# Altium project ESC_Project.PrjPcb
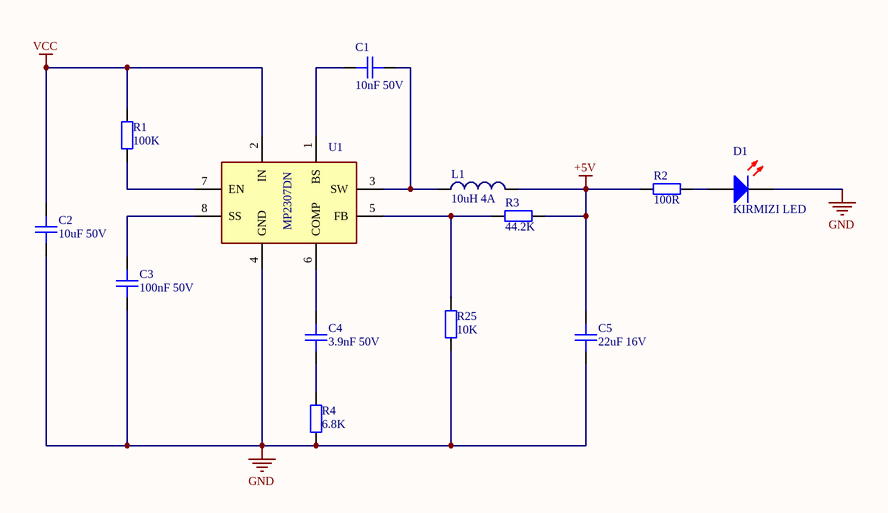
[diagram p0: Power.SchDoc]
3 sheets, 62 parts. Net scope: global (net labels, ports and power ports of the same name join across sheets).
Board file: ESC_PCB.PcbDoc
Sheets:
  Power.SchDoc
  Driver.SchDoc
  MCU.SchDoc

## Sheet Power.SchDoc
size A4

### Parts
C1  Deger: 10nF 50V  [CAP 0805/2012]  (hidden comment: CAP CER 10000PF 50V X7R 0805)
C2  Deger: 10uF 50V  [CAP 1206/3216]  (hidden comment: CAP CER 10UF 50V X5R 1206)
C3  Deger: 100nF 50V  [CAP 0805/2012]  (hidden comment: CAP CER 0.1UF 50V X7R 0805)
C4  Deger: 3.9nF 50V  [CAP 0805/2012]  (hidden comment: CAP CER 3900PF 50V X7R 0805)
C5  Deger: 22uF 16V  [CAP 1206/3216]  (hidden comment: CAP CERAMIC 22UF 16V X7S 20% PAD)
D1  Deger: KIRMIZI LED  [SMD: LED 0805/2012 RED]  (hidden comment: Red 645nm LED Indication - Discrete 1.8V 0805)
L1  FIXED IND 10UH 4A 68 MOHM SMD  [ASPI-0630LR-100M-T15]  (value not drawn)
R1  Deger: 100K  [RES_0805]  (hidden comment: RES SMD 100K OHM 1% 1/8W 0805)
R2  Deger: 100R  [RES_0805]  (hidden comment: RES SMD 100 OHM 1% 1/8W 0805)
R3  Deger: 44.2K  [RES_0805]  (hidden comment: RES SMD 44.2K OHM 1% 1/8W 0805)
R4  Deger: 6.8K  [RES_0805]  (hidden comment: RES SMD 6.8K OHM 1% 1/8W 0805)
R25  Deger: 10K  [RES_0805]  (hidden comment: RES SMD 10K OHM 1% 1/8W 0805)
U1  IC REG BUCK ADJUSTABLE 3A 8SOIC  [SOIC8_PAD]  (value not drawn)

### Nets
+5V: C5.2 L1.2 R2.1 R3.2
GND: C2.1 C3.1 C5.1 D1.2(K) R4.1 R25.1 U1.4(GND)
VCC: C2.2 R1.2 U1.2(IN)
NetC1_1: C1.1 U1.1(BS)
NetC1_2: C1.2 L1.1 U1.3(SW)
NetC3_2: C3.2 U1.8(SS)
NetC4_1: C4.1 R4.2
NetC4_2: C4.2 U1.6(COMP)
NetD1_1: D1.1(A) R2.2
NetR1_1: R1.1 U1.7(EN)
NetR3_1: R3.1 R25.2 U1.5(FB)

### Library data of the parts
C1 = 10nF 50V 0805: 10000pF ±10% 50V Ceramic Capacitor X7R 0805 (2012 Metric); Cins: Kondansator; Uretici Kodu: CL21B103KBANNNC; Kılıf: 0805; -Sicaklik: -55; +Sicaklik: +125; Lehim Yöntemi: SMD; MSL: 1 (Unlimited)
C2 = 10uF 50V 1206: 10µF ±10% 50V Ceramic Capacitor X5R 1206 (3216 Metric); Cins: Kondansator; Uretici Kodu: CL31A106KBHNNNE; Kılıf: 1206; -Sicaklik: -55; +Sicaklik: +125; Lehim Yöntemi: SMD; MSL: 1 (Unlimited)
C3 = 100nF 50V 0805: 0.1µF ±10% 50V Ceramic Capacitor X7R 0805 (2012 Metric); Kılıf: 0805; Cins: Kondansator; Uretici Kodu: CL21B104KBCNNNC; -Sicaklik: -55; +Sicaklik: +125; Lehim Yöntemi: SMD; MSL: 1 (Unlimited)
C4 = 3.9nF 50V 0805: 3900pF ±10% 50V Ceramic Capacitor X7R 0805 (2012 Metric); Cins: Kondansator; Uretici Kodu: CL21B392KBANNNC; Kılıf: 0805; -Sicaklik: -55; +Sicaklik: +125; Lehim Yöntemi: SMD; MSL: 1 (Unlimited)
C5 = 22uF 16V 1206: 22µF ±20% 16V Ceramic Capacitor X7S 1206 (3216 Metric); Cins: Kondansator; Uretici Kodu: GRM31CC71C226ME11L; Kılıf: 1206; -Sicaklik: -55; +Sicaklik: +125; Lehim Yöntemi: SMD; MSL: 1 (Unlimited)
D1 = LED_Kırmızı: LED RED DIFFUSED 0805 SMD; Uretici Kodu: LH R974-LP-1; Kılıf: 0805; -Sicaklik: -40; +Sicaklik: +125; Cins: LED; Lehim Yöntemi: SMD; MSL: 1 (Unlimited)
L1 = 10uH 4A: 10µH Shielded Molded Inductor 4A 68mOhm Max Nonstandard; Cins: Bobin; -Sicaklik: -55; +Sicaklik: +125; Uretici Kodu: ASPI-0630LR-100M-T15; Kılıf: Nonstandard; Lehim Yöntemi: SMD; MSL: 1 (Unlimited); Deger: 10uH 4A
R1 = 100K 0805: 100 kOhms ±1% 0.125W, 1/8W Chip Resistor 0805 (2012 Metric) Moisture Resistant Thick Film; Cins: Direnc; Uretici Kodu: RC0805FR-07100KL; Kılıf: 0805; -Sicaklik: -55; +Sicaklik: +155; Lehim Yöntemi: SMD; MSL: 1 (Unlimited)
R2 = 100R 0805: 100 Ohms ±1% 0.125W, 1/8W Chip Resistor 0805 (2012 Metric) Moisture Resistant Thick Film; Cins: Direnc; Uretici Kodu: RC0805FR-07100RL; Kılıf: 0805; -Sicaklik: -55; +Sicaklik: +155; Lehim Yöntemi: SMD; MSL: 1 (Unlimited)
R3 = 44.2K 0805: 44.2 kOhms ±1% 0.125W, 1/8W Chip Resistor 0805 (2012 Metric) Moisture Resistant Thick Film; Cins: Direnc; Uretici Kodu: RC0805FR-0744K2L; Kılıf: 0805; -Sicaklik: -55; +Sicaklik: +155; Lehim Yöntemi: SMD; MSL: 1 (Unlimited)
R4 = 6.8K 0805: 6.8 kOhms ±1% 0.125W, 1/8W Chip Resistor 0805 (2012 Metric) Moisture Resistant Thick Film; Cins: Direnc; Kılıf: 0805; Uretici Kodu: RC0805FR-076K8L; -Sicaklik: -55; +Sicaklik: +155; Lehim Yöntemi: SMD; MSL: 1 (Unlimited)
R25 = 10K 0805: 10 kOhms ±1% 0.125W, 1/8W Chip Resistor 0805 (2012 Metric) Moisture Resistant Thick Film; Cins: Direnc; Kılıf: 0805; Uretici Kodu: RC0805FR-0710KL; -Sicaklik: -55; +Sicaklik: +155; Lehim Yöntemi: SMD; MSL: 1 (Unlimited)
U1 = MP2307DN: Buck Switching Regulator IC Positive Adjustable 0.925V 1 Output 3A 8-SOIC (0.154", 3.90mm Width) Exposed Pad; Uretici Kodu: MP2307DN-LF-Z; -Sicaklik: -40; +Sicaklik: +85; Lehim Yöntemi: SMD; Cins: IC; Kılıf: 8-SOIC; MSL: 2A (4 Weeks); Deger: MP2307DN

## Sheet Driver.SchDoc
size A4
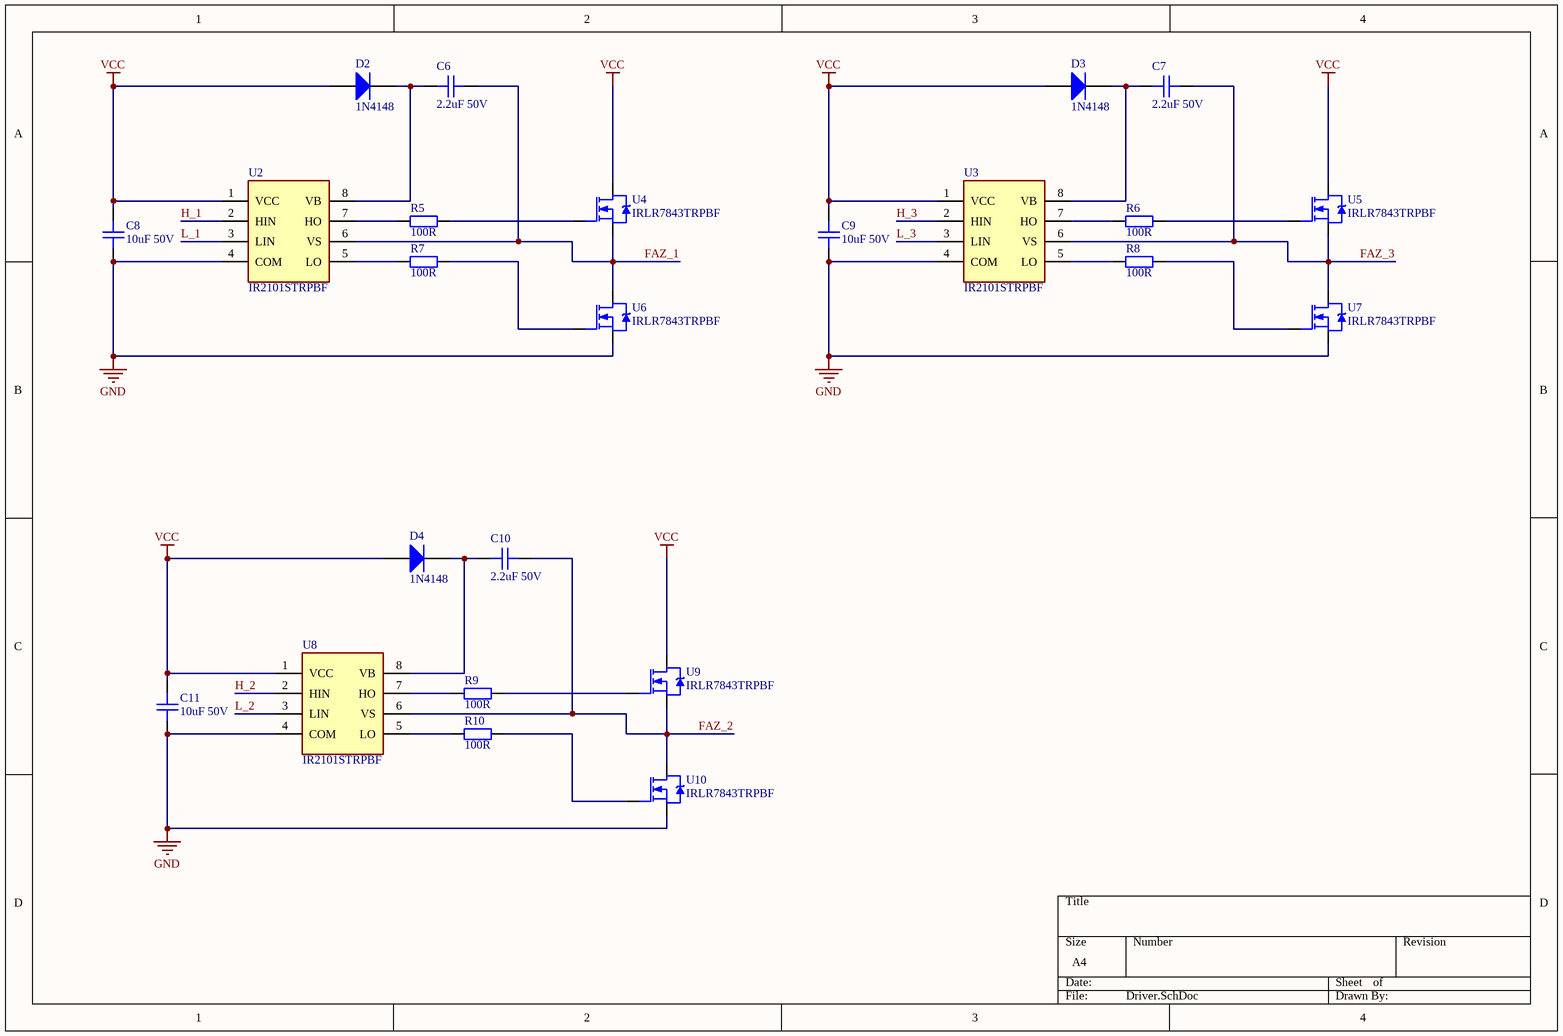
[diagram p1: Driver.SchDoc]

### Parts
C6  Deger: 2.2uF 50V  [CAP 1206/3216]  (hidden comment: CAP CER 2.2UF 50V X5R 1206)
C7  Deger: 2.2uF 50V  [CAP 1206/3216]  (hidden comment: CAP CER 2.2UF 50V X5R 1206)
C8  Deger: 10uF 50V  [CAP 1206/3216]  (hidden comment: CAP CER 10UF 50V X5R 1206)
C9  Deger: 10uF 50V  [CAP 1206/3216]  (hidden comment: CAP CER 10UF 50V X5R 1206)
C10  Deger: 2.2uF 50V  [CAP 1206/3216]  (hidden comment: CAP CER 2.2UF 50V X5R 1206)
C11  Deger: 10uF 50V  [CAP 1206/3216]  (hidden comment: CAP CER 10UF 50V X5R 1206)
D2  1N4148 Diyot  [SOD-123]  (value not drawn)
D3  1N4148 Diyot  [SOD-123]  (value not drawn)
D4  1N4148 Diyot  [SOD-123]  (value not drawn)
R5  Deger: 100R  [RES_0805]  (hidden comment: RES SMD 100 OHM 1% 1/8W 0805)
R6  Deger: 100R  [RES_0805]  (hidden comment: RES SMD 100 OHM 1% 1/8W 0805)
R7  Deger: 100R  [RES_0805]  (hidden comment: RES SMD 100 OHM 1% 1/8W 0805)
R8  Deger: 100R  [RES_0805]  (hidden comment: RES SMD 100 OHM 1% 1/8W 0805)
R9  Deger: 100R  [RES_0805]  (hidden comment: RES SMD 100 OHM 1% 1/8W 0805)
R10  Deger: 100R  [RES_0805]  (hidden comment: RES SMD 100 OHM 1% 1/8W 0805)
U2  Deger: IR2101STRPBF  [SOIC8]  (hidden comment: IC GATE DRVR HALF-BRIDGE 8SOIC)
U3  Deger: IR2101STRPBF  [SOIC8]  (hidden comment: IC GATE DRVR HALF-BRIDGE 8SOIC)
U4  Deger: IRLR7843TRPBF  [DPAK]  (hidden comment: MOSFET N-CH 30V 161A DPAK)
U5  Deger: IRLR7843TRPBF  [DPAK]  (hidden comment: MOSFET N-CH 30V 161A DPAK)
U6  Deger: IRLR7843TRPBF  [DPAK]  (hidden comment: MOSFET N-CH 30V 161A DPAK)
U7  Deger: IRLR7843TRPBF  [DPAK]  (hidden comment: MOSFET N-CH 30V 161A DPAK)
U8  Deger: IR2101STRPBF  [SOIC8]  (hidden comment: IC GATE DRVR HALF-BRIDGE 8SOIC)
U9  Deger: IRLR7843TRPBF  [DPAK]  (hidden comment: MOSFET N-CH 30V 161A DPAK)
U10  Deger: IRLR7843TRPBF  [DPAK]  (hidden comment: MOSFET N-CH 30V 161A DPAK)

### Nets
GND: C8.1 C9.1 C11.1 U2.4(COM) U3.4(COM) U6.3(S) U7.3(S) U8.4(COM) U10.3(S)
VCC: C8.2 C9.2 C11.2 D2.1(A) D3.1(A) D4.1(A) U2.1(VCC) U3.1(VCC) U4.4(D) U5.4(D) U8.1(VCC) U9.4(D)
FAZ_1: C6.2 U2.6(VS) U4.3(S) U6.4(D)
FAZ_2: C10.2 U8.6(VS) U9.3(S) U10.4(D)
FAZ_3: C7.2 U3.6(VS) U5.3(S) U7.4(D)
H_1: U2.2(HIN)
H_2: U8.2(HIN)
H_3: U3.2(HIN)
L_1: U2.3(LIN)
L_2: U8.3(LIN)
L_3: U3.3(LIN)
NetC6_1: C6.1 D2.2(K) U2.8(VB)
NetC7_1: C7.1 D3.2(K) U3.8(VB)
NetC10_1: C10.1 D4.2(K) U8.8(VB)
NetR5_1: R5.1 U2.7(HO)
NetR5_2: R5.2 U4.1(G)
NetR6_1: R6.1 U3.7(HO)
NetR6_2: R6.2 U5.1(G)
NetR7_1: R7.1 U2.5(LO)
NetR7_2: R7.2 U6.1(G)
NetR8_1: R8.1 U3.5(LO)
NetR8_2: R8.2 U7.1(G)
NetR9_1: R9.1 U8.7(HO)
NetR9_2: R9.2 U9.1(G)
NetR10_1: R10.1 U8.5(LO)
NetR10_2: R10.2 U10.1(G)

### Library data of the parts
C6 C7 C10 = 2.2uF 50V 1206: 2.2µF ±10% 50V Ceramic Capacitor X5R 1206 (3216 Metric); Cins: Kondansator; Uretici Kodu: CL31A225KBHNNNE; Kılıf: 1206; -Sicaklik: -55; +Sicaklik: +85; Lehim Yöntemi: SMD; MSL: 1 (Unlimited)
C8 C9 C11 = 10uF 50V 1206: as C2 on sheet Power; MSL: 1 (Unlimited)
D2-D4 = 1N4148: DIODE GEN PURP 100V 150MA SOD123; Uretici Kodu: 1N4148W-TP; -Sicaklik: -65; +Sicaklik: +150; Lehim Yöntemi: SMD; Cins: Diyot; Kılıf: SOD123; MSL: 1 (Unlimited); Deger: 1N4148
R5-R10 = 100R 0805: as R2 on sheet Power; Lehim Yöntemi: SMD; MSL: 1 (Unlimited)
U2 U3 U8 = IR2101: Half-Bridge Gate Driver IC Non-Inverting 8-SOIC; -Sicaklik: -40; +Sicaklik: +150; Lehim Yöntemi: SMD; Cins: IC; Uretici Kodu: IR2101STRPBF; Kılıf: 8-SOIC; MSL: 2A (4 Weeks)
U4-U7 U9 U10 = IRLR7843: N-Channel 30V 161A (Tc) 140W (Tc) Surface Mount D-Pak; Kılıf: DPAK(TO-252-3); -Sicaklik: -55; +Sicaklik: +175; Lehim Yöntemi: SMD; Cins: MOSFET; Uretici Kodu: IRLR7843TRPBF; MSL: 1 (Unlimited)

## Sheet MCU.SchDoc
size A4
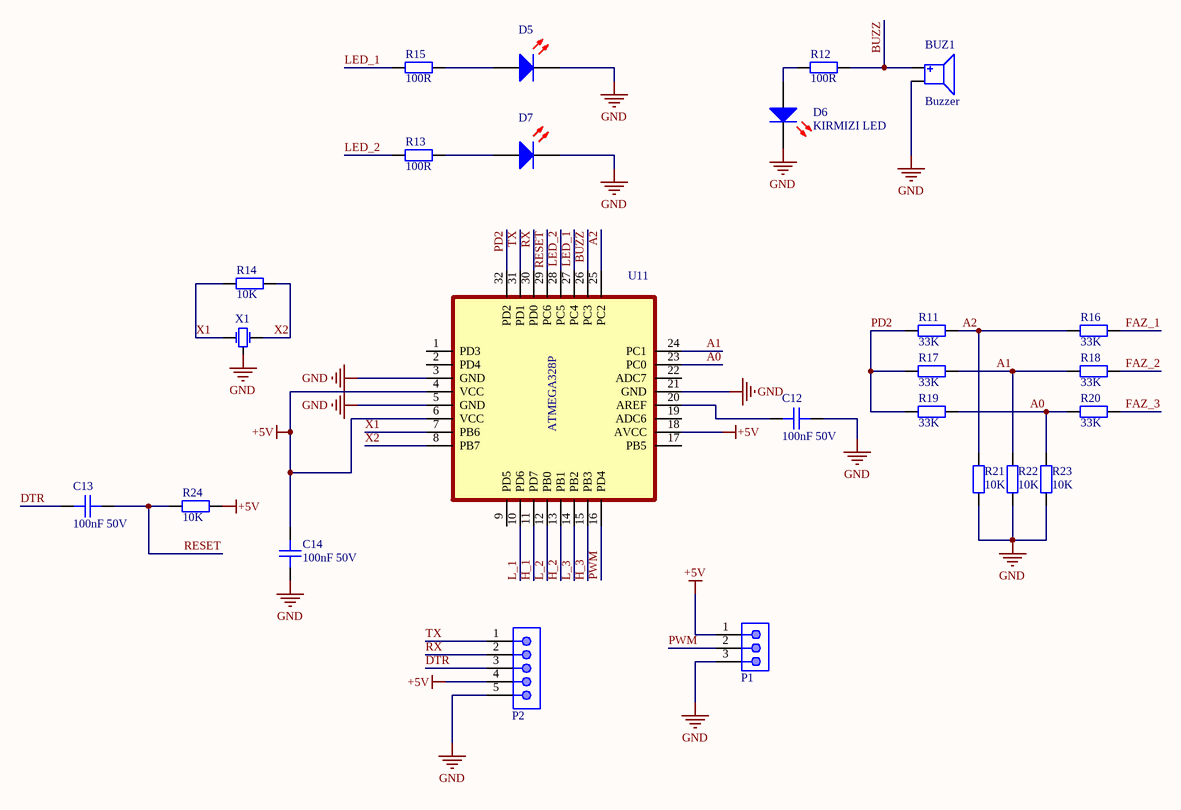
[diagram p2: MCU.SchDoc]

### Parts
BUZ1  Deger: Buzzer  [BUZ: CMT-7525]  (hidden comment: BUZZER MAGN 3.6V 7.5X7.5MM SMD)
C12  Deger: 100nF 50V  [CAP 0805/2012]  (hidden comment: CAP CER 0.1UF 50V X7R 0805)
C13  Deger: 100nF 50V  [CAP 0805/2012]  (hidden comment: CAP CER 0.1UF 50V X7R 0805)
C14  Deger: 100nF 50V  [CAP 0805/2012]  (hidden comment: CAP CER 0.1UF 50V X7R 0805)
D5  Red 645nm LED Indication - Discrete 1.8V 0805  [SMD: LED 0805/2012 RED]  (value not drawn)
D6  Deger: KIRMIZI LED  [SMD: LED 0805/2012 RED]  (hidden comment: Red 645nm LED Indication - Discrete 1.8V 0805)
D7  Red 645nm LED Indication - Discrete 1.8V 0805  [SMD: LED 0805/2012 RED]  (value not drawn)
P1  WR-PHD 2.54 mm Angled Socket Header  [PWM_CONN]  (value not drawn)
P2  WR-PHD 2.54 mm Angled Socket Header  [TTL_CONN_5]  (value not drawn)
R11  Deger: 33K  [RES_0805]  (hidden comment: RES SMD 33K OHM 1% 1/8W 0805)
R12  Deger: 100R  [RES_0805]  (hidden comment: RES SMD 100 OHM 1% 1/8W 0805)
R13  Deger: 100R  [RES_0805]  (hidden comment: RES SMD 100 OHM 1% 1/8W 0805)
R14  Deger: 10K  [RES_0805]  (hidden comment: RES SMD 10K OHM 1% 1/8W 0805)
R15  Deger: 100R  [RES_0805]  (hidden comment: RES SMD 100 OHM 1% 1/8W 0805)
R16  Deger: 33K  [RES_0805]  (hidden comment: RES SMD 33K OHM 1% 1/8W 0805)
R17  Deger: 33K  [RES_0805]  (hidden comment: RES SMD 33K OHM 1% 1/8W 0805)
R18  Deger: 33K  [RES_0805]  (hidden comment: RES SMD 33K OHM 1% 1/8W 0805)
R19  Deger: 33K  [RES_0805]  (hidden comment: RES SMD 33K OHM 1% 1/8W 0805)
R20  Deger: 33K  [RES_0805]  (hidden comment: RES SMD 33K OHM 1% 1/8W 0805)
R21  Deger: 10K  [RES_0805]  (hidden comment: RES SMD 10K OHM 1% 1/8W 0805)
R22  Deger: 10K  [RES_0805]  (hidden comment: RES SMD 10K OHM 1% 1/8W 0805)
R23  Deger: 10K  [RES_0805]  (hidden comment: RES SMD 10K OHM 1% 1/8W 0805)
R24  Deger: 10K  [RES_0805]  (hidden comment: RES SMD 10K OHM 1% 1/8W 0805)
U11  IC MCU 8BIT 32KB FLASH 32TQFP  [TQFP32]  (value not drawn)
X1  CERAMIC RES 16.0000MHZ 15PF SMD  [CRYSTAL_16MHZ(CTSE16)]  (value not drawn)

### Nets
+5V: C14.1 P1.1 P2.4 R24.2 U11.4(VCC) U11.6(VCC) U11.18(AVCC)
GND: BUZ1.2(Negative) C12.2 C14.2 D5.2(K) D6.2(K) D7.2(K) P1.3 P2.5 R21.1 R22.1 R23.1 U11.3(GND) U11.5(GND) U11.21(GND) X1.2(GND)
A0: R19.2 R20.1 R23.2 U11.23(PC0)
A1: R17.2 R18.1 R22.2 U11.24(PC1)
A2: R11.2 R16.1 R21.2 U11.25(PC2)
BUZZ: BUZ1.1(Positive) R12.2 U11.26(PC3)
DTR: C13.1 P2.3
FAZ_1: R16.2
FAZ_2: R18.2
FAZ_3: R20.2
H_1: U11.11(PD7)
H_2: U11.13(PB1)
H_3: U11.15(PB3)
L_1: U11.10(PD6)
L_2: U11.12(PB0)
L_3: U11.14(PB2)
LED_1: R15.1 U11.27(PC4)
LED_2: R13.1 U11.28(PC5)
PD2: R11.1 R17.1 R19.1 U11.32(PD2)
PWM: P1.2 U11.16(PD4)
RESET: C13.2 R24.1 U11.29(PC6)
RX: P2.2 U11.30(PD0)
TX: P2.1 U11.31(PD1)
X1: R14.1 U11.7(PB6) X1.1(OSC1)
X2: R14.2 U11.8(PB7) X1.3(OSC2)
NetC12_1: C12.1 U11.20(AREF)
NetD5_1: D5.1(A) R15.2
NetD6_1: D6.1(A) R12.1
NetD7_1: D7.1(A) R13.2

Not connected (* = marked no-connect by the designer): U11 1(PD3) 2(PD4) 9(PD5) 17(PB5) 19(ADC6) 22(ADC7)

### Library data of the parts
BUZ1 = Buzzer(CMT-7525-80-SMT-TR): Buzzers Transducer, Externally Driven Magnetic 3.6V 100mA 2.73kHz 80dB @ 3.6V, 10cm Surface Mount Solder Pads; Kılıf: Nonstandard; -Sicaklik: -40; +Sicaklik: +85; Cins: Buzzer; Uretici Kodu: CMT-7525-80-SMT-TR; MSL: 1 (Unlimited); Lehim Yöntemi: SMD
C12-C14 = 100nF 50V 0805: as C3 on sheet Power; MSL: 1 (Unlimited)
D5 D7 = LED_Kırmızı: LED RED DIFFUSED 0805 SMD; Uretici Kodu: LH R974-LP-1; Kılıf: 0805; -Sicaklik: -40; +Sicaklik: +125; Deger: KIRMIZI LED; Cins: LED; Lehim Yöntemi: SMD; MSL: 1 (Unlimited)
D6 = LED_Kırmızı: as D1 on sheet Power; Cins: LED; Lehim Yöntemi: SMD; MSL: 1 (Unlimited)
P1 = HDR(1X3): Cins: Konnektor; Uretici Kodu: 613003143121; Kılıf: 3POS 2.54MM; -Sicaklik: -40; +Sicaklik: +105; Lehim Yöntemi: MANUEL; MSL: 1 (Unlimited)
P2 = HDR(1X5): Cins: Konnektor; Uretici Kodu: 613005143121; Kılıf: 5POS 2.54MM; -Sicaklik: -40; +Sicaklik: +105; Lehim Yöntemi: MANUEL; MSL: 1 (Unlimited)
R11 R16-R20 = 33K 0805: 33 kOhms ±1% 0.125W, 1/8W Chip Resistor 0805 (2012 Metric) Moisture Resistant Thick Film; Cins: Direnc; Kılıf: 0805; -Sicaklik: -55; +Sicaklik: +155; Uretici Kodu: RC0805FR-0733KL; MSL: 1 (Unlimited); Lehim Yöntemi: SMD
R12 R13 R15 = 100R 0805: as R2 on sheet Power; Lehim Yöntemi: SMD; MSL: 1 (Unlimited)
R14 R21-R24 = 10K 0805: as R25 on sheet Power; Lehim Yöntemi: SMD; MSL: 1 (Unlimited)
U11 = ATMEGA328P: AVR AVR® ATmega Microcontroller IC 8-Bit 20MHz 32KB (16K x 16) FLASH 32-TQFP (7x7); Uretici Kodu: RC0805FR-07100RL; -Sicaklik: -40; +Sicaklik: +85; Lehim Yöntemi: SMD; Cins: IC; Kılıf: 32-TQFP; MSL: 3 (168 Hours); Deger: ATMEGA328P
X1 = CRYSTAL 16.0000MHZ(CSTCE16M0V53-R0): 16MHz Ceramic Resonator Built in Capacitor 15pF ±0.3%  -20°C ~ 80°C Surface Mount; Cins: Kristal; Kılıf: 3-SMD; -Sicaklik: -20; +Sicaklik: +80; Deger: 16 MHZ 15PF; Uretici Kodu: CSTCE16M0V53-R0; Lehim Yöntemi: SMD; MSL: 1 (Unlimited)

## Nets that join several sheets
+5V: Power (C5.2 L1.2 R2.1 R3.2), MCU (7 pins)
GND: Power (7 pins), Driver (9 pins), MCU (15 pins)
VCC: Power (C2.2 R1.2 U1.2), Driver (12 pins)
FAZ_1: Driver (C6.2 U2.6 U4.3 U6.4), MCU (R16.2)
FAZ_2: Driver (C10.2 U8.6 U9.3 U10.4), MCU (R18.2)
FAZ_3: Driver (C7.2 U3.6 U5.3 U7.4), MCU (R20.2)
H_1: Driver (U2.2), MCU (U11.11)
H_2: Driver (U8.2), MCU (U11.13)
H_3: Driver (U3.2), MCU (U11.15)
L_1: Driver (U2.3), MCU (U11.10)
L_2: Driver (U8.3), MCU (U11.12)
L_3: Driver (U3.3), MCU (U11.14)